# Altium project SAMA7D65-Curiosity.PrjPcb (part 4 of 12)

## Sheet 06 - SAMA7D65-DDR3L.SchDoc
size B; CompanyName: Microchip Technology Inc.; Organization: Microchip Technology; Address1: 2355 West Chandler Blvd.; Address2: Chandler, AZ  85224; Address4: USA; DocumentNumber: 6; SheetNumber: 6; SheetTotal: 15; SheetTitle: SAMA7D65 DDR3L
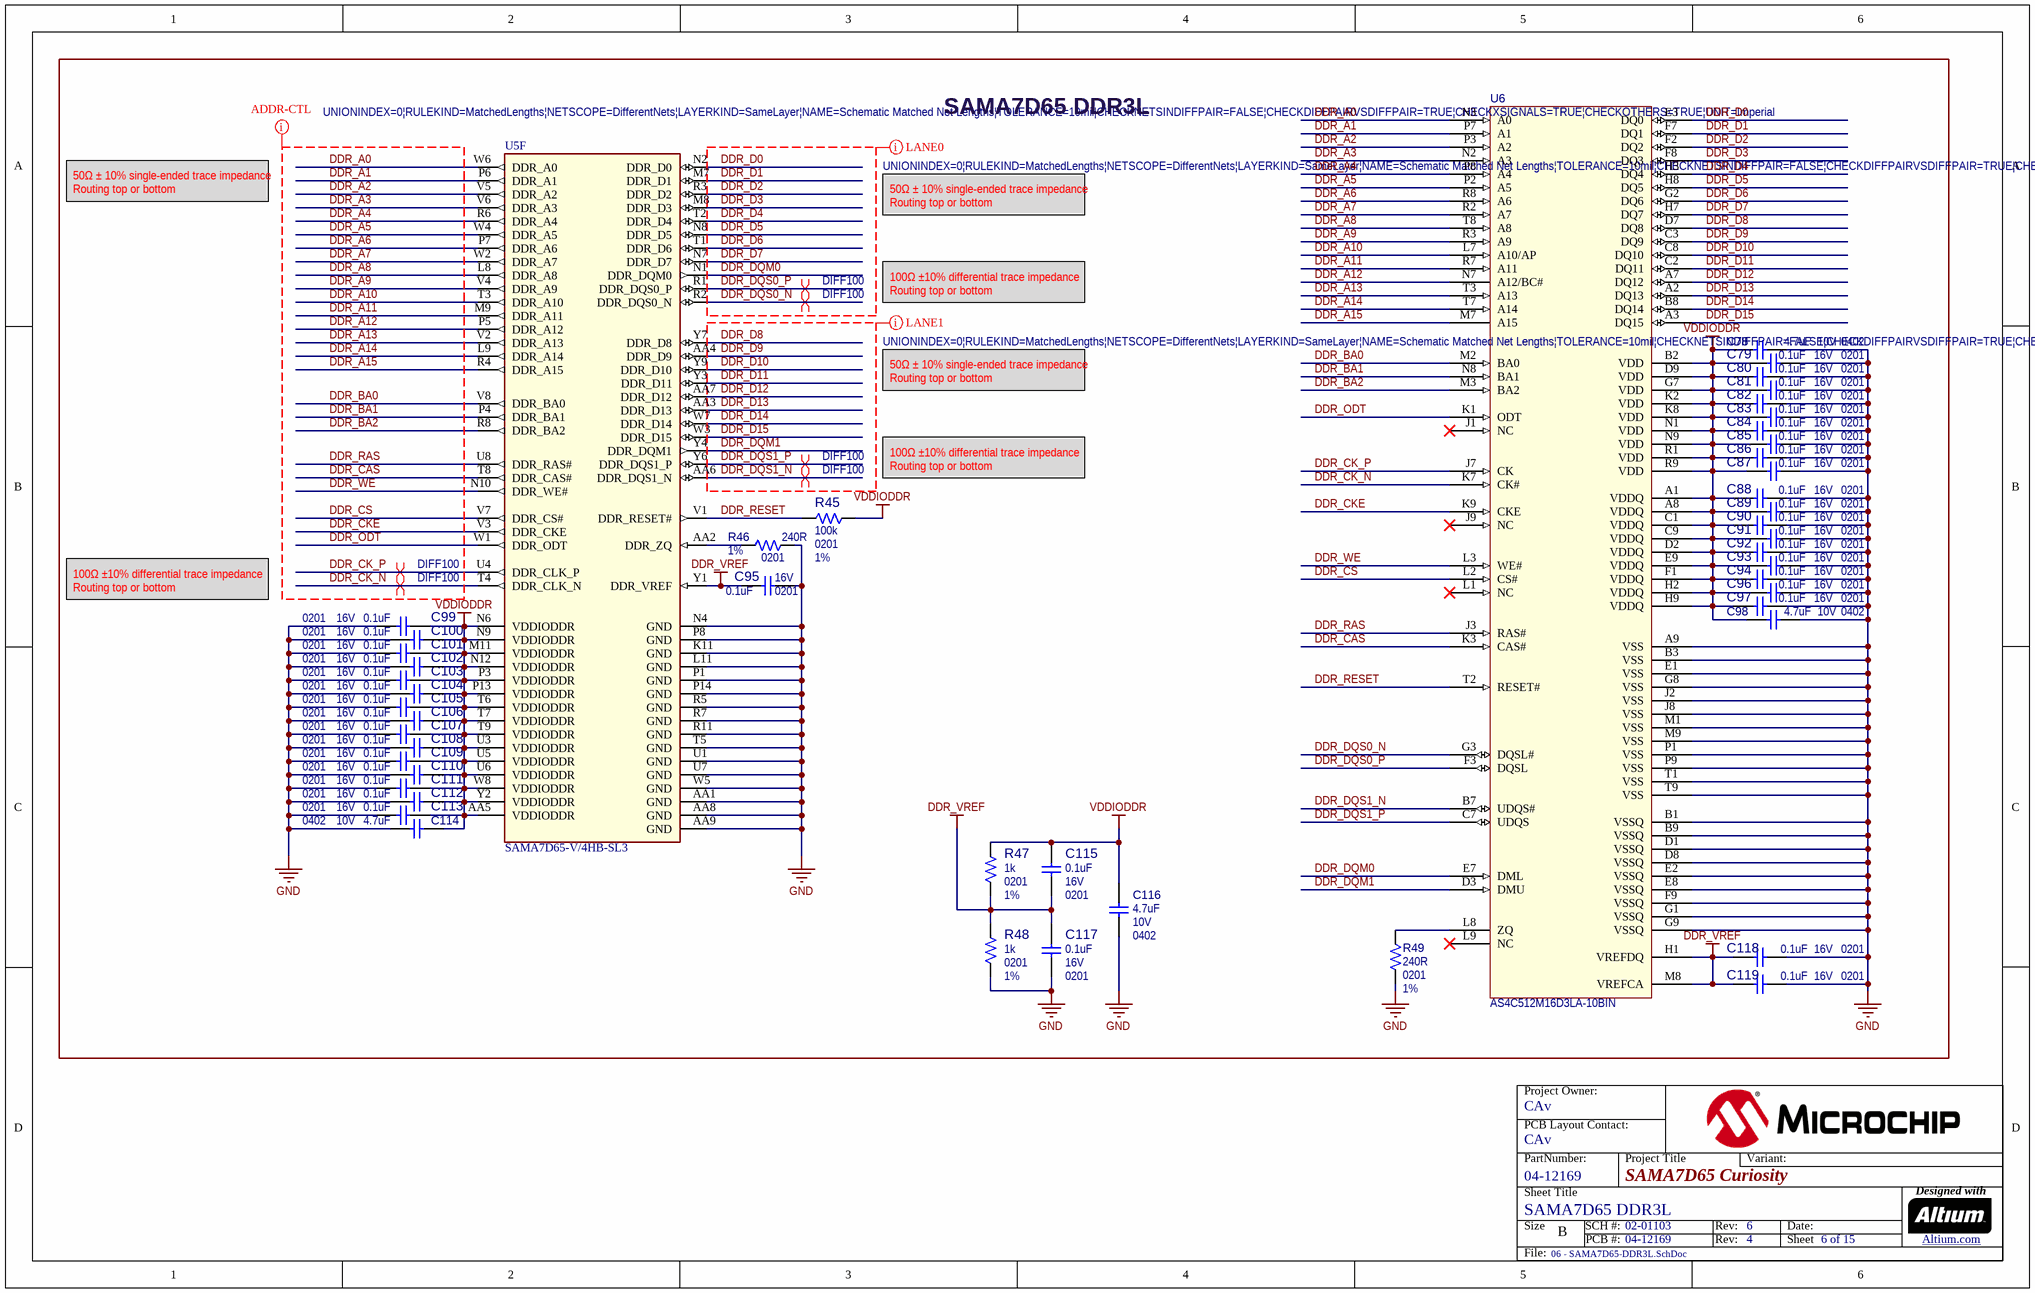
[diagram p5: 06 - SAMA7D65-DDR3L.SchDoc]

### Parts
C78  value 4.7uF  Voltage: 10V  Package: 0402  [CAP_C_0402]  (hidden comment: Capacitor NP)
C79  value 0.1uF  Voltage: 16V  Package: 0201  [CAP_C_0201]  (hidden comment: Capacitor NP)
C80  value 0.1uF  Voltage: 16V  Package: 0201  [CAP_C_0201]  (hidden comment: Capacitor NP)
C81  value 0.1uF  Voltage: 16V  Package: 0201  [CAP_C_0201]  (hidden comment: Capacitor NP)
C82  value 0.1uF  Voltage: 16V  Package: 0201  [CAP_C_0201]  (hidden comment: Capacitor NP)
C83  value 0.1uF  Voltage: 16V  Package: 0201  [CAP_C_0201]  (hidden comment: Capacitor NP)
C84  value 0.1uF  Voltage: 16V  Package: 0201  [CAP_C_0201]  (hidden comment: Capacitor NP)
C85  value 0.1uF  Voltage: 16V  Package: 0201  [CAP_C_0201]  (hidden comment: Capacitor NP)
C86  value 0.1uF  Voltage: 16V  Package: 0201  [CAP_C_0201]  (hidden comment: Capacitor NP)
C87  value 0.1uF  Voltage: 16V  Package: 0201  [CAP_C_0201]  (hidden comment: Capacitor NP)
C88  value 0.1uF  Voltage: 16V  Package: 0201  [CAP_C_0201]  (hidden comment: Capacitor NP)
C89  value 0.1uF  Voltage: 16V  Package: 0201  [CAP_C_0201]  (hidden comment: Capacitor NP)
C90  value 0.1uF  Voltage: 16V  Package: 0201  [CAP_C_0201]  (hidden comment: Capacitor NP)
C91  value 0.1uF  Voltage: 16V  Package: 0201  [CAP_C_0201]  (hidden comment: Capacitor NP)
C92  value 0.1uF  Voltage: 16V  Package: 0201  [CAP_C_0201]  (hidden comment: Capacitor NP)
C93  value 0.1uF  Voltage: 16V  Package: 0201  [CAP_C_0201]  (hidden comment: Capacitor NP)
C94  value 0.1uF  Voltage: 16V  Package: 0201  [CAP_C_0201]  (hidden comment: Capacitor NP)
C95  value 0.1uF  Voltage: 16V  Package: 0201  [CAP_C_0201]  (hidden comment: Capacitor NP)
C96  value 0.1uF  Voltage: 16V  Package: 0201  [CAP_C_0201]  (hidden comment: Capacitor NP)
C97  value 0.1uF  Voltage: 16V  Package: 0201  [CAP_C_0201]  (hidden comment: Capacitor NP)
C98  value 4.7uF  Voltage: 10V  Package: 0402  [CAP_C_0402]  (hidden comment: Capacitor NP)
C99  value 0.1uF  Voltage: 16V  Package: 0201  [CAP_C_0201]  (hidden comment: Capacitor NP)
C100  value 0.1uF  Voltage: 16V  Package: 0201  [CAP_C_0201]  (hidden comment: Capacitor NP)
C101  value 0.1uF  Voltage: 16V  Package: 0201  [CAP_C_0201]  (hidden comment: Capacitor NP)
C102  value 0.1uF  Voltage: 16V  Package: 0201  [CAP_C_0201]  (hidden comment: Capacitor NP)
C103  value 0.1uF  Voltage: 16V  Package: 0201  [CAP_C_0201]  (hidden comment: Capacitor NP)
C104  value 0.1uF  Voltage: 16V  Package: 0201  [CAP_C_0201]  (hidden comment: Capacitor NP)
C105  value 0.1uF  Voltage: 16V  Package: 0201  [CAP_C_0201]  (hidden comment: Capacitor NP)
C106  value 0.1uF  Voltage: 16V  Package: 0201  [CAP_C_0201]  (hidden comment: Capacitor NP)
C107  value 0.1uF  Voltage: 16V  Package: 0201  [CAP_C_0201]  (hidden comment: Capacitor NP)
C108  value 0.1uF  Voltage: 16V  Package: 0201  [CAP_C_0201]  (hidden comment: Capacitor NP)
C109  value 0.1uF  Voltage: 16V  Package: 0201  [CAP_C_0201]  (hidden comment: Capacitor NP)
C110  value 0.1uF  Voltage: 16V  Package: 0201  [CAP_C_0201]  (hidden comment: Capacitor NP)
C111  value 0.1uF  Voltage: 16V  Package: 0201  [CAP_C_0201]  (hidden comment: Capacitor NP)
C112  value 0.1uF  Voltage: 16V  Package: 0201  [CAP_C_0201]  (hidden comment: Capacitor NP)
C113  value 0.1uF  Voltage: 16V  Package: 0201  [CAP_C_0201]  (hidden comment: Capacitor NP)
C114  value 4.7uF  Voltage: 10V  Package: 0402  [CAP_C_0402]  (hidden comment: Capacitor NP)
C115  value 0.1uF  Voltage: 16V  Package: 0201  [CAP_C_0201]  (hidden comment: Capacitor NP)
C116  value 4.7uF  Voltage: 10V  Package: 0402  [CAP_C_0402]  (hidden comment: Capacitor NP)
C117  value 0.1uF  Voltage: 16V  Package: 0201  [CAP_C_0201]  (hidden comment: Capacitor NP)
C118  value 0.1uF  Voltage: 16V  Package: 0201  [CAP_C_0201]  (hidden comment: Capacitor NP)
C119  value 0.1uF  Voltage: 16V  Package: 0201  [CAP_C_0201]  (hidden comment: Capacitor NP)
R45  value 100k  Package: 0201  Tolerance: 1%  [RES_C_0201]  (hidden comment: Resistor)
R46  value 240R  Package: 0201  Tolerance: 1%  [RES_C_0201]  (hidden comment: Resistor)
R47  value 1k  Package: 0201  Tolerance: 1%  [RES_C_0201]  (hidden comment: Resistor)
R48  value 1k  Package: 0201  Tolerance: 1%  [RES_C_0201]  (hidden comment: Resistor)
R49  value 240R  Package: 0201  Tolerance: 1%  [RES_C_0201]  (hidden comment: Resistor)
U5  value SAMA7D65-V/4HB-SL3  [TFBGA-343_14x14]  (hidden comment: SAMA7D65)  (part F of 8)
U6  value AS4C512M16D3LA-10BIN  [TFBGA-96_13.5x9]  (hidden comment: AS4C512M16D3LA-10BIN TFBGA-96)

### Blocks framed on the sheet
SAMA7D65 DDR3L: C78-C119 R45-R49 U5 U6

### Nets
DDR_VREF: C95.1 C115.2 C117.1 C118.1 C119.1 R47.1 R48.2 U5.Y1(DDR_VREF) U6.H1(VREFDQ) U6.M8(VREFCA)
GND: C78.1 C79.2 C80.2 C81.2 C82.2 C83.2 C84.2 C85.2 C86.2 C87.2 C88.2 C89.2 C90.2 C91.2 C92.2 C93.2 C94.2 C95.2 C96.2 C97.2 C98.1 C99.2 C100.2 C101.2 C102.2 C103.2 C104.2 C105.2 C106.2 C107.2 C108.2 C109.2 C110.2 C111.2 C112.2 C113.2 C114.2 C116.1 C117.2 C118.2 C119.2 R46.2 R48.1 R49.1 U5.AA1(GND) U5.AA8(GND) U5.AA9(GND) U5.K11(GND) U5.L11(GND) U5.N4(GND) U5.P1(GND) U5.P8(GND) U5.P14(GND) U5.R5(GND) U5.R7(GND) U5.R11(GND) U5.T5(GND) U5.U1(GND) U5.U7(GND) U5.W5(GND) U6.A9(VSS) U6.B1(VSSQ) U6.B3(VSS) U6.B9(VSSQ) U6.D1(VSSQ) U6.D8(VSSQ) U6.E1(VSS) U6.E2(VSSQ) U6.E8(VSSQ) U6.F9(VSSQ) U6.G1(VSSQ) U6.G8(VSS) U6.G9(VSSQ) U6.J2(VSS) U6.J8(VSS) U6.M1(VSS) U6.M9(VSS) U6.P1(VSS) U6.P9(VSS) U6.T1(VSS) U6.T9(VSS)
VDDIODDR: C78.2 C79.1 C80.1 C81.1 C82.1 C83.1 C84.1 C85.1 C86.1 C87.1 C88.1 C89.1 C90.1 C91.1 C92.1 C93.1 C94.1 C96.1 C97.1 C98.2 C99.1 C100.1 C101.1 C102.1 C103.1 C104.1 C105.1 C106.1 C107.1 C108.1 C109.1 C110.1 C111.1 C112.1 C113.1 C114.1 C115.1 C116.2 R45.2 R47.2 U5.AA5(VDDIODDR) U5.M11(VDDIODDR) U5.N6(VDDIODDR) U5.N9(VDDIODDR) U5.N12(VDDIODDR) U5.P3(VDDIODDR) U5.P13(VDDIODDR) U5.T6(VDDIODDR) U5.T7(VDDIODDR) U5.T9(VDDIODDR) U5.U3(VDDIODDR) U5.U5(VDDIODDR) U5.U6(VDDIODDR) U5.W8(VDDIODDR) U5.Y2(VDDIODDR) U6.A1(VDDQ) U6.A8(VDDQ) U6.B2(VDD) U6.C1(VDDQ) U6.C9(VDDQ) U6.D2(VDDQ) U6.D9(VDD) U6.E9(VDDQ) U6.F1(VDDQ) U6.G7(VDD) U6.H2(VDDQ) U6.H9(VDDQ) U6.K2(VDD) U6.K8(VDD) U6.N1(VDD) U6.N9(VDD) U6.R1(VDD) U6.R9(VDD)
DDR_A0: U5.W6(DDR_A0) U6.N3(A0)
DDR_A1: U5.P6(DDR_A1) U6.P7(A1)
DDR_A2: U5.V5(DDR_A2) U6.P3(A2)
DDR_A3: U5.V6(DDR_A3) U6.N2(A3)
DDR_A4: U5.R6(DDR_A4) U6.P8(A4)
DDR_A5: U5.W4(DDR_A5) U6.P2(A5)
DDR_A6: U5.P7(DDR_A6) U6.R8(A6)
DDR_A7: U5.W2(DDR_A7) U6.R2(A7)
DDR_A8: U5.L8(DDR_A8) U6.T8(A8)
DDR_A9: U5.V4(DDR_A9) U6.R3(A9)
DDR_A10: U5.T3(DDR_A10) U6.L7(A10/AP)
DDR_A11: U5.M9(DDR_A11) U6.R7(A11)
DDR_A12: U5.P5(DDR_A12) U6.N7(A12/BC#)
DDR_A13: U5.V2(DDR_A13) U6.T3(A13)
DDR_A14: U5.L9(DDR_A14) U6.T7(A14)
DDR_A15: U5.R4(DDR_A15) U6.M7(A15)
DDR_BA0: U5.V8(DDR_BA0) U6.M2(BA0)
DDR_BA1: U5.P4(DDR_BA1) U6.N8(BA1)
DDR_BA2: U5.R8(DDR_BA2) U6.M3(BA2)
DDR_CAS: U5.T8(DDR_CAS#) U6.K3(CAS#)
DDR_CK_N: U5.T4(DDR_CLK_N) U6.K7(CK#)
DDR_CK_P: U5.U4(DDR_CLK_P) U6.J7(CK)
DDR_CKE: U5.V3(DDR_CKE) U6.K9(CKE)
DDR_CS: U5.V7(DDR_CS#) U6.L2(CS#)
DDR_D0: U5.N2(DDR_D0) U6.E3(DQ0)
DDR_D1: U5.M7(DDR_D1) U6.F7(DQ1)
DDR_D2: U5.R3(DDR_D2) U6.F2(DQ2)
DDR_D3: U5.M8(DDR_D3) U6.F8(DQ3)
DDR_D4: U5.T2(DDR_D4) U6.H3(DQ4)
DDR_D5: U5.N8(DDR_D5) U6.H8(DQ5)
DDR_D6: U5.T1(DDR_D6) U6.G2(DQ6)
DDR_D7: U5.N7(DDR_D7) U6.H7(DQ7)
DDR_D8: U5.Y7(DDR_D8) U6.D7(DQ8)
DDR_D9: U5.AA4(DDR_D9) U6.C3(DQ9)
DDR_D10: U5.Y9(DDR_D10) U6.C8(DQ10)
DDR_D11: U5.Y3(DDR_D11) U6.C2(DQ11)
DDR_D12: U5.AA7(DDR_D12) U6.A7(DQ12)
DDR_D13: U5.AA3(DDR_D13) U6.A2(DQ13)
DDR_D14: U5.W7(DDR_D14) U6.B8(DQ14)
DDR_D15: U5.W3(DDR_D15) U6.A3(DQ15)
DDR_DQM0: U5.N1(DDR_DQM0) U6.E7(DML)
DDR_DQM1: U5.Y4(DDR_DQM1) U6.D3(DMU)
DDR_DQS0_N: U5.R2(DDR_DQS0_N) U6.G3(DQSL#)
DDR_DQS0_P: U5.R1(DDR_DQS0_P) U6.F3(DQSL)
DDR_DQS1_N: U5.AA6(DDR_DQS1_N) U6.B7(UDQS#)
DDR_DQS1_P: U5.Y6(DDR_DQS1_P) U6.C7(UDQS)
DDR_ODT: U5.W1(DDR_ODT) U6.K1(ODT)
DDR_RAS: U5.U8(DDR_RAS#) U6.J3(RAS#)
DDR_RESET: R45.1 U5.V1(DDR_RESET#) U6.T2(RESET#)
DDR_WE: U5.N10(DDR_WE#) U6.L3(WE#)
NetR46_1: R46.1 U5.AA2(DDR_ZQ)
NetR49_2: R49.2 U6.L8(ZQ)

Not connected (* = marked no-connect by the designer): U6 J1(NC)* J9(NC)* L1(NC)* L9(NC)*

### Layout directives
net class DDR-ADDR-CTL; rule Matched Net Lengths [Tolerance = 10mil]: DDR_A0, DDR_A1, DDR_A2, DDR_A3, DDR_A4, DDR_A5, DDR_A6, DDR_A7, DDR_A8, DDR_A9, DDR_A10, DDR_A11, DDR_A12, DDR_A13, DDR_A14, DDR_A15, DDR_BA0, DDR_BA1, DDR_BA2, DDR_CAS, DDR_CK_N, DDR_CK_P, DDR_CKE, DDR_CS, DDR_ODT, DDR_RAS, DDR_WE
differential pair; differential pair class DIFF100; net class DIFF100; rule Matched Net Lengths [Tolerance = 4mil]: DDR_CK_N, DDR_CK_P, DDR_DQS0_N, DDR_DQS0_P, DDR_DQS1_N, DDR_DQS1_P
net class DDR-LANE0; rule Matched Net Lengths [Tolerance = 10mil]: DDR_D0, DDR_D1, DDR_D2, DDR_D3, DDR_D4, DDR_D5, DDR_D6, DDR_D7, DDR_DQM0, DDR_DQS0_N, DDR_DQS0_P
net class DDR-LANE1; rule Matched Net Lengths [Tolerance = 10mil]: DDR_D8, DDR_D9, DDR_D10, DDR_D11, DDR_D12, DDR_D13, DDR_D14, DDR_D15, DDR_DQM1, DDR_DQS1_N, DDR_DQS1_P

### Notes on the sheet
- 50Ω ± 10% single-ended trace impedance
  Routing top or bottom
- 100Ω ±10% differential trace impedance
  Routing top or bottom
- Project Owner:
- PCB Layout Contact:
- PartNumber:
- Project Title
- Variant:
- Sheet Title
- Size
- B
- SCH #:
- PCB #:
- Rev:
- Date:
- Sheet
- Designed with
- Altium.com <http://go.altium.com/MicrochipLandingPage_Evaluation.html>
- File:

### Library data of the parts
C78 C98 C114 C116 = CAP1684: Capacitor; Manufacturer 1: TDK Corporation; Manufacturer Part Number 1: C1005X5R1A475K050BC; Description_: CAP CER 4.7uF 10V 10% X5R SMD 0402; Dev Tools Status: Production; Tolerance: 10%; Temperature Coeffcient: X5R; Type: Ceramic; Owner: Jesus Aviles; Populated: YES; MCHP-ID: CAP1684; Revision: 1; Symbol: Capacitor NP; Status: MCL Design; ComponentLink1Description: SVN Datasheet; ComponentLink2Description: Local Datasheet; ComponentLink3URL: C:\ALTIUM_WORK\00001_MCHP-CDB\Library\LibraryRefs\Capacitor NP.SchLib; ComponentLink3Description: Open Symbol; ComponentLink4URL: C:\ALTIUM_WORK\00001_MCHP-CDB\Library\Footprints\CAP_C_0402.PcbLib; ComponentLink4Description: Open Footprint; ComponentLink5Description: Open Footprint 2; ComponentLink6Description: Open Footprint 3; ComponentLink7Description: Open Footprint 4; Operating Temperature: -55C to 85C; Category: Capacitor; Supplier 1: Digi-Key; Supplier Part Number 1: 445-13820-1-ND; Quantity Override: 1
C79-C97 C99-C113 C115 C117-C119 = CAP1978: Manufacturer 1: D3_Murata Electronics; Manufacturer Part Number 1: GRM033C71C104KE14J; Description_: CAP CER 0.1uF 16V 10% X7S 0201; Dev Tools Status: Production; Tolerance: 10%; Owner: Dragos Danaila; Populated: YES; Temperature Coefficient: X7S; Restricted Sourcing: No; MCHP-ID: CAP1978; Revision: 2; Symbol: Capacitor NP; Status: MCL Design; ComponentLink1URL: https://chn-vm-apps.microchip.com/mchprepo/parts/Datasheets/GRM033C71C104KE14-01.pdf; ComponentLink1Description: SVN Datasheet; ComponentLink2URL: C:\ALTIUM_WORK\00001_MCHP-CDB\Datasheets\GRM033C71C104KE14-01.pdf; ComponentLink2Description: Local Datasheet; ComponentLink3URL: C:\ALTIUM_WORK\00001_MCHP-CDB\Library\LibraryRefs\Capacitor NP.SchLib; ComponentLink3Description: Open Symbol; ComponentLink4URL: C:\ALTIUM_WORK\00001_MCHP-CDB\Library\Footprints\CAP_C_0201.PcbLib; ComponentLink4Description: Open Footprint; ComponentLink5Description: Open Footprint 2; ComponentLink6Description: Open Footprint 3; ComponentLink7Description: Open Footprint 4; Operating Temperature: -55C to +125C; Category: Capacitor; Supplier 1: Mouser; Supplier Part Number 1: 81-GRM033C71C104KE4J; Quantity Override: 1; Manufacturer 2: D3_Murata Electronics; Manufacturer Part Number 2: GRM033C71C104KE14E; Manufacturer 3: Murata; Manufacturer Part Number 3: GRM033C71C104KE14D; Supplier 2: Mouser; Supplier Part Number 2: 81-GRM033C71C104KE4E; Supplier 3: Digi-Key; Supplier Part Number 3: 490-10387-1-ND
R45 = RSMT1356: Manufacturer 1: Stackpole Electronics Inc; Manufacturer Part Number 1: RMCF0201FT100K; Description_: RES TKF 100k 1% 1/20W SMD 0201; Dev Tools Status: Production; Voltage: 25V; Power: 1/20W; Owner: Ciprian Abramov; Populated: YES; Temperature Coefficient: 200ppm/C; Restricted Sourcing: No; MCHP-ID: RSMT1356; Revision: 2; Symbol: Resistor; Status: MCL Design; ComponentLink1URL: https://chn-vm-apps.microchip.com/mchprepo/parts/Datasheets/sei-rmcf_rmcp.pdf; ComponentLink1Description: SVN Datasheet; ComponentLink2URL: C:\ALTIUM_WORK\00001_MCHP-CDB\Datasheets\sei-rmcf_rmcp.pdf; ComponentLink2Description: Local Datasheet; ComponentLink3URL: C:\ALTIUM_WORK\00001_MCHP-CDB\Library\LibraryRefs\Resistor.SchLib; ComponentLink3Description: Open Symbol; ComponentLink4URL: C:\ALTIUM_WORK\00001_MCHP-CDB\Library\Footprints\RES_C_0201.PcbLib; ComponentLink4Description: Open Footprint; ComponentLink5Description: Open Footprint 2; ComponentLink6Description: Open Footprint 3; ComponentLink7Description: Open Footprint 4; Operating Temperature: -55C to +125C; Category: Resistor; Type: RES SMD; Composition: TKF; Supplier 1: Digi-Key; Supplier Part Number 1: RMCF0201FT100KCT-ND; Quantity Override: 1
R46 R49 = RSMT1249: Manufacturer 1: Yageo; Manufacturer Part Number 1: RC0201FR-07240RL; Description_: RES TKF 240R 1% 1/20W SMD 0201; Dev Tools Status: Production; Voltage: 25V; Temperature Coefficient: 200ppm; Current: 0.5A; Power: 1/20W; Owner: Dragos Danaila; Populated: YES; MCHP-ID: RSMT1249; Revision: 1; Symbol: Resistor; Status: MCL Design; ComponentLink1URL: https://chn-vm-apps.microchip.com/mchprepo/parts/Datasheets/PYu-RC_Group_51_RoHS_L_9.pdf; ComponentLink1Description: SVN Datasheet; ComponentLink2URL: C:\ALTIUM_WORK\00001_MCHP-CDB\Datasheets\PYu-RC_Group_51_RoHS_L_9.pdf; ComponentLink2Description: Local Datasheet; ComponentLink3URL: C:\ALTIUM_WORK\00001_MCHP-CDB\Library\LibraryRefs\Resistor.SchLib; ComponentLink3Description: Open Symbol; ComponentLink4URL: C:\ALTIUM_WORK\00001_MCHP-CDB\Library\Footprints\RES_C_0201.PcbLib; ComponentLink4Description: Open Footprint; ComponentLink5Description: Open Footprint 2; ComponentLink6Description: Open Footprint 3; ComponentLink7Description: Open Footprint 4; Operating Temperature: -55C to +125C; Category: Resistor; Type: RES SMD; Composition: TKF; Supplier 1: Digi-Key; Supplier Part Number 1: YAG2528CT-ND; Quantity Override: 1
R47 R48 = RES1588: Manufacturer 1: Vishay; Manufacturer Part Number 1: CRCW02011K00FNED; Description_: RES TKF 1k 1% 1/20W SMD 0201; Dev Tools Status: Production; Voltage: 25V; Power: 1/20W; Owner: Gabor Bihari; Populated: YES; MCHP-ID: RES1588; Revision: 3; Symbol: Resistor; Status: MCL Design; ComponentLink1URL: https://chn-vm-apps.microchip.com/mchprepo/parts/Datasheets/ERJ_G,R,E_Rev08.pdf; ComponentLink1Description: SVN Datasheet; ComponentLink2URL: C:\ALTIUM_WORK\00001_MCHP-CDB\Datasheets\ERJ_G,R,E_Rev08.pdf; ComponentLink2Description: Local Datasheet; ComponentLink3URL: C:\ALTIUM_WORK\00001_MCHP-CDB\Library\LibraryRefs\Resistor.SchLib; ComponentLink3Description: Open Symbol; ComponentLink4URL: C:\ALTIUM_WORK\00001_MCHP-CDB\Library\Footprints\RES_C_0201.PcbLib; ComponentLink4Description: Open Footprint; ComponentLink5Description: Open Footprint 2; ComponentLink6Description: Open Footprint 3; ComponentLink7Description: Open Footprint 4; Operating Temperature: -55°C to 125°C; Category: Resistor; Type: RES SMD; Composition: TKF; Supplier 1: Digi-Key; Supplier Part Number 1: 541-1.00KABTR-ND; Quantity Override: 1
U5 = IC2674: SAMA7D65 MPU 1000MHz Cortex-A7 TFBGA-343; Manufacturer 1: Microchip Technology; MCHP-ID: IC2674; Description_: MCHP MPU 32-BIT Cortex-A7 1000MHz 128kB SAMA7D65-V/4HB-SL3 TFBGA-343; Dev Tools Status: Design; Owner: Ciprian Abramov; Populated: YES; Restricted Sourcing: No; Symbol: SAMA7D65-TFBGA-343; Type: 32-Bit MPU; Status: MCL Design; Revision: 1; Category: MCHP-Microcontroller; ComponentLink1URL: https://www.microchip.com/sitesearch/search/Product%20and%20Development%20Tools/SAMA7D65-V/4HB-SL3; ComponentLink1Description: SVN Datasheet; ComponentLink2Description: Local Datasheet; ComponentLink3URL: C:\ALTIUM_WORK\00001_MCHP-CDB\Library\LibraryRefs\SAMA7D65-TFBGA-343.SchLib; ComponentLink3Description: Open Symbol; ComponentLink4URL: C:\ALTIUM_WORK\00001_MCHP-CDB\Library\Footprints\TFBGA-343_14x14.PcbLib; ComponentLink4Description: Open Footprint; ComponentLink5Description: Open Footprint 2; ComponentLink6Description: Open Footprint 3; ComponentLink7Description: Open Footprint 4; Manufacturer Part Number 1: SAMA7D65-V/4HB-SL3; Supplier 1: Microchip Technology; Supplier Part Number 1: SAMA7D65-V/4HB-SL3; Operating Temperature: -40C to +105C; Quantity Override: 1
U6 = IC1748: 8Gb DDR3L-1866 SDRAM, 512Mb x 16, -40C to +95C; Manufacturer 1: Alliance Memory, Inc.; MCHP-ID: IC1748; Description_: IC MEMORY AS4C512M16D3LA-10BIN DDR3L 8Gb 933MHz FBGA-96; Dev Tools Status: Design; Vin: 1.35V; Owner: Ciprian Abramov; Populated: YES; Restricted Sourcing: No; Revision: 1; Symbol: AS4C512M16D3LA-10BIN TFBGA-96; Status: MCL Design; Package: TFBGA-96; ComponentLink1URL: https://chn-vm-apps.microchip.com/mchprepo/parts/Datasheets/AllianceMemory_DDR3L_8G_AS4C512M16D3LA-10BCN-BIN-BAN_Feb2019_v1.0.pdf; ComponentLink1Description: SVN Datasheet; ComponentLink2URL: C:\ALTIUM_WORK\00001_MCHP-CDB\Datasheets\AllianceMemory_DDR3L_8G_AS4C512M16D3LA-10BCN-BIN-BAN_Feb2019_v1.0.pdf; ComponentLink2Description: Local Datasheet; ComponentLink3URL: C:\ALTIUM_WORK\00001_MCHP-CDB\Library\LibraryRefs\AS4C512M16D3LA-10BIN TFBGA-96.SchLib; ComponentLink3Description: Open Symbol; ComponentLink4URL: C:\ALTIUM_WORK\00001_MCHP-CDB\Library\Footprints\TFBGA-96_13.5x9.PcbLib; ComponentLink4Description: Open Footprint; ComponentLink5Description: Open Footprint 2; ComponentLink6Description: Open Footprint 3; ComponentLink7Description: Open Footprint 4; Operating Temperature: -40C to +95C; Type: Memory; Category: IC; Manufacturer Part Number 1: AS4C512M16D3LA-10BIN; Supplier 1: Digi-Key; Supplier Part Number 1: 1450-1488-ND; Quantity Override: 1

## Sheet 07 - SAMA7D65-PIO.SchDoc
size B; CompanyName: Microchip Technology Inc.; Organization: Microchip Technology; Address1: 2355 West Chandler Blvd.; Address2: Chandler, AZ  85224; Address4: USA; DocumentNumber: 7; SheetNumber: 7; SheetTotal: 15; SheetTitle: PIO Asignment
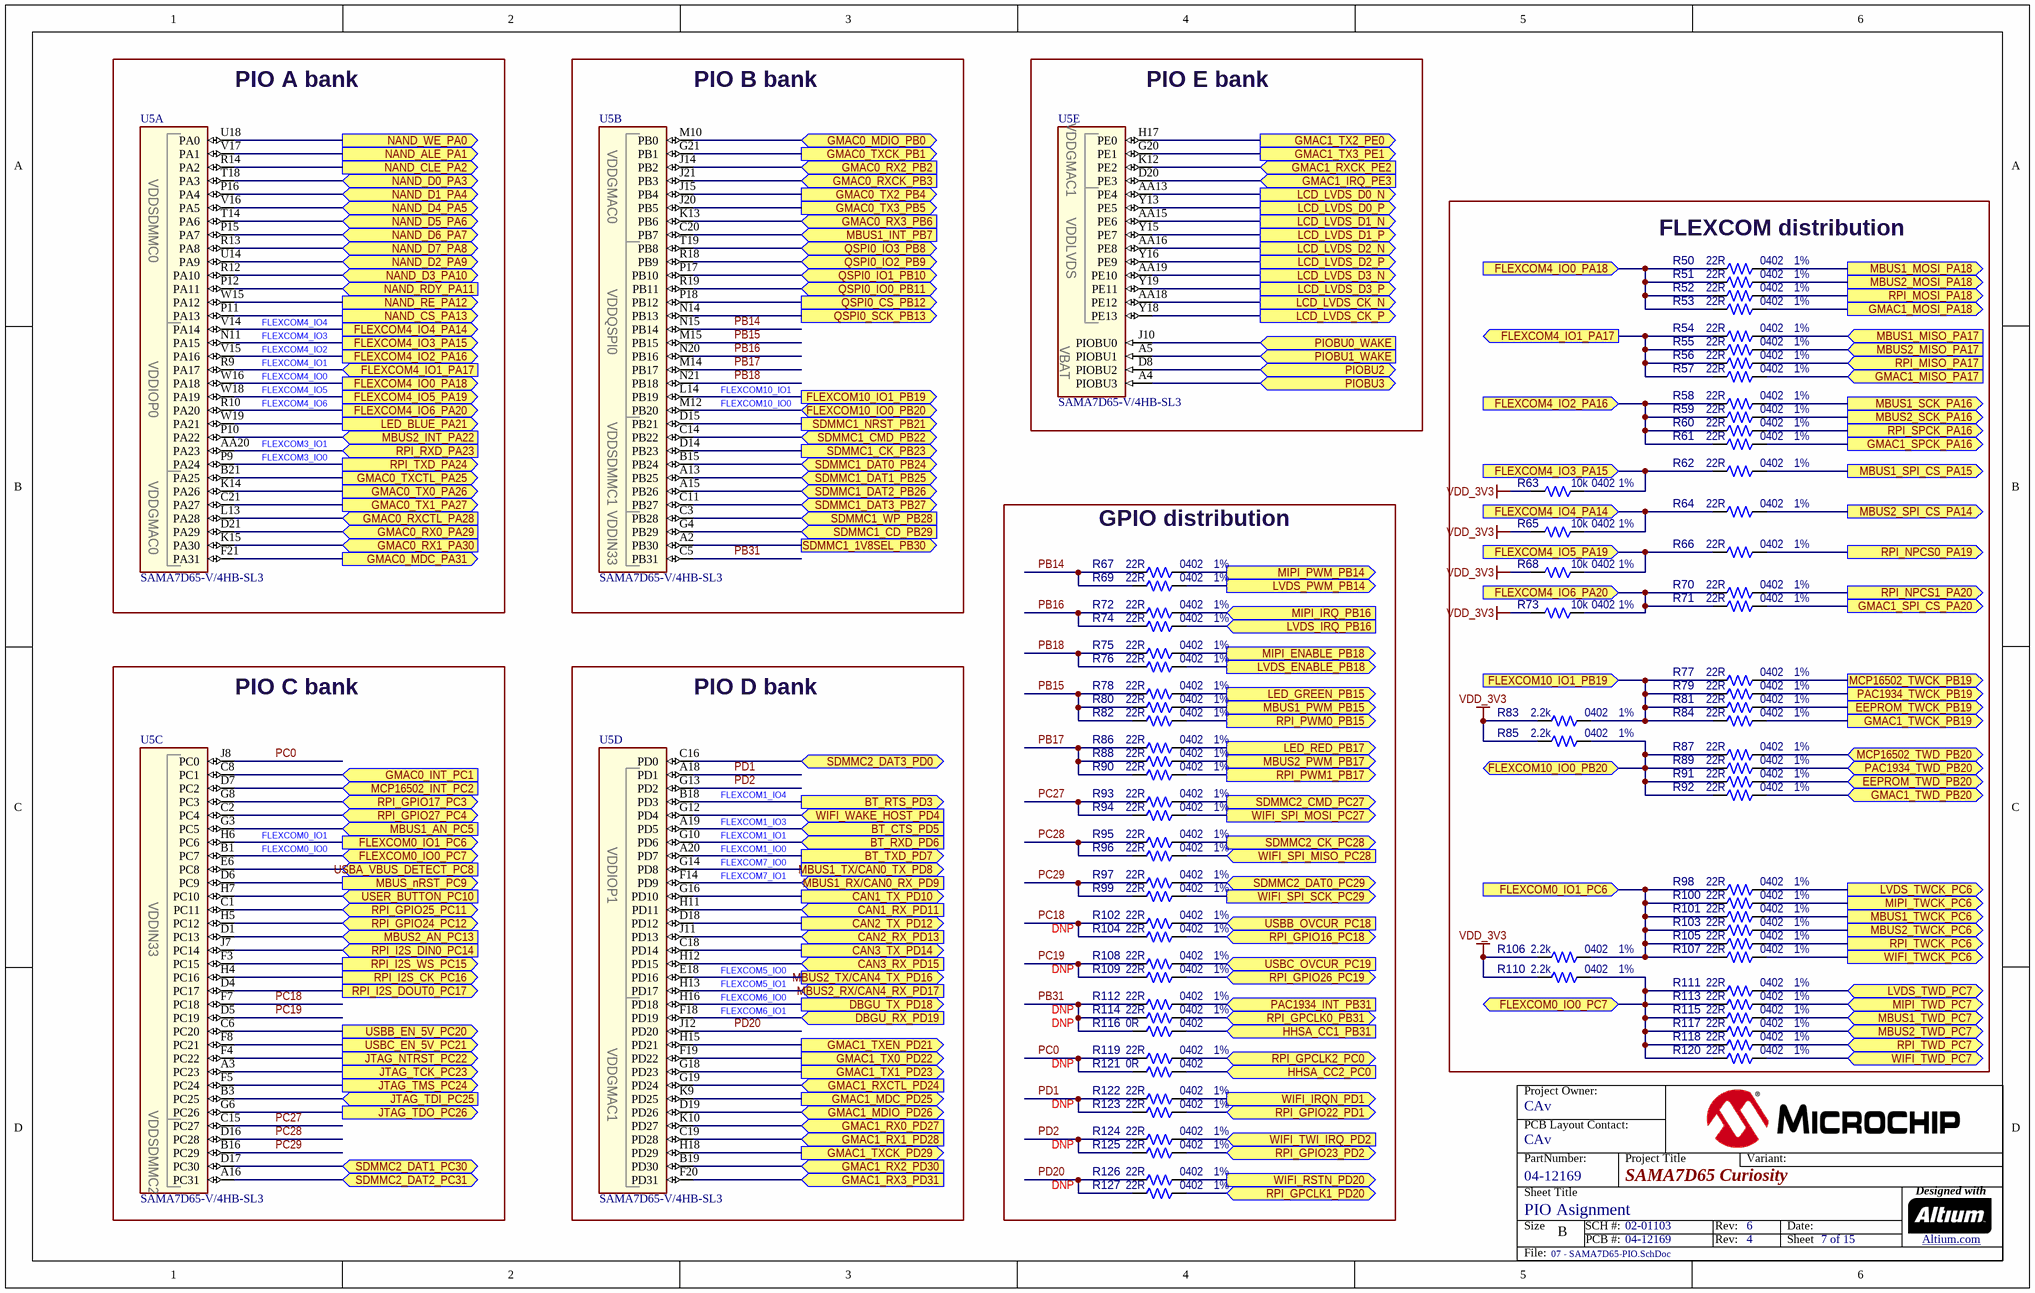
[diagram p6: 07 - SAMA7D65-PIO.SchDoc]

### Parts
R50  value 22R  Package: 0402  Tolerance: 1%  [RES_C_0402]  (hidden comment: Resistor)
R51  value 22R  Package: 0402  Tolerance: 1%  [RES_C_0402]  (hidden comment: Resistor)
R52  value 22R  Package: 0402  Tolerance: 1%  [RES_C_0402]  (hidden comment: Resistor)
R53  value 22R  Package: 0402  Tolerance: 1%  [RES_C_0402]  (hidden comment: Resistor)
R54  value 22R  Package: 0402  Tolerance: 1%  [RES_C_0402]  (hidden comment: Resistor)
R55  value 22R  Package: 0402  Tolerance: 1%  [RES_C_0402]  (hidden comment: Resistor)
R56  value 22R  Package: 0402  Tolerance: 1%  [RES_C_0402]  (hidden comment: Resistor)
R57  value 22R  Package: 0402  Tolerance: 1%  [RES_C_0402]  (hidden comment: Resistor)
R58  value 22R  Package: 0402  Tolerance: 1%  [RES_C_0402]  (hidden comment: Resistor)
R59  value 22R  Package: 0402  Tolerance: 1%  [RES_C_0402]  (hidden comment: Resistor)
R60  value 22R  Package: 0402  Tolerance: 1%  [RES_C_0402]  (hidden comment: Resistor)
R61  value 22R  Package: 0402  Tolerance: 1%  [RES_C_0402]  (hidden comment: Resistor)
R62  value 22R  Package: 0402  Tolerance: 1%  [RES_C_0402]  (hidden comment: Resistor)
R63  value 10k  Package: 0402  Tolerance: 1%  [RES_C_0402]  (hidden comment: Resistor)
R64  value 22R  Package: 0402  Tolerance: 1%  [RES_C_0402]  (hidden comment: Resistor)
R65  value 10k  Package: 0402  Tolerance: 1%  [RES_C_0402]  (hidden comment: Resistor)
R66  value 22R  Package: 0402  Tolerance: 1%  [RES_C_0402]  (hidden comment: Resistor)
R67  value 22R  Package: 0402  Tolerance: 1%  [RES_C_0402]  (hidden comment: Resistor)
R68  value 10k  Package: 0402  Tolerance: 1%  [RES_C_0402]  (hidden comment: Resistor)
R69  value 22R  Package: 0402  Tolerance: 1%  [RES_C_0402]  (hidden comment: Resistor)
R70  value 22R  Package: 0402  Tolerance: 1%  [RES_C_0402]  (hidden comment: Resistor)
R71  value 22R  Package: 0402  Tolerance: 1%  [RES_C_0402]  (hidden comment: Resistor)
R72  value 22R  Package: 0402  Tolerance: 1%  [RES_C_0402]  (hidden comment: Resistor)
R73  value 10k  Package: 0402  Tolerance: 1%  [RES_C_0402]  (hidden comment: Resistor)
R74  value 22R  Package: 0402  Tolerance: 1%  [RES_C_0402]  (hidden comment: Resistor)
R75  value 22R  Package: 0402  Tolerance: 1%  [RES_C_0402]  (hidden comment: Resistor)
R76  value 22R  Package: 0402  Tolerance: 1%  [RES_C_0402]  (hidden comment: Resistor)
R77  value 22R  Package: 0402  Tolerance: 1%  [RES_C_0402]  (hidden comment: Resistor)
R78  value 22R  Package: 0402  Tolerance: 1%  [RES_C_0402]  (hidden comment: Resistor)
R79  value 22R  Package: 0402  Tolerance: 1%  [RES_C_0402]  (hidden comment: Resistor)
R80  value 22R  Package: 0402  Tolerance: 1%  [RES_C_0402]  (hidden comment: Resistor)
R81  value 22R  Package: 0402  Tolerance: 1%  [RES_C_0402]  (hidden comment: Resistor)
R82  value 22R  Package: 0402  Tolerance: 1%  [RES_C_0402]  (hidden comment: Resistor)
R83  value 2.2k  Package: 0402  Tolerance: 1%  [RES_C_0402]  (hidden comment: Resistor)
R84  value 22R  Package: 0402  Tolerance: 1%  [RES_C_0402]  (hidden comment: Resistor)
R85  value 2.2k  Package: 0402  Tolerance: 1%  [RES_C_0402]  (hidden comment: Resistor)
R86  value 22R  Package: 0402  Tolerance: 1%  [RES_C_0402]  (hidden comment: Resistor)
R87  value 22R  Package: 0402  Tolerance: 1%  [RES_C_0402]  (hidden comment: Resistor)
R88  value 22R  Package: 0402  Tolerance: 1%  [RES_C_0402]  (hidden comment: Resistor)
R89  value 22R  Package: 0402  Tolerance: 1%  [RES_C_0402]  (hidden comment: Resistor)
R90  value 22R  Package: 0402  Tolerance: 1%  [RES_C_0402]  (hidden comment: Resistor)
R91  value 22R  Package: 0402  Tolerance: 1%  [RES_C_0402]  (hidden comment: Resistor)
R92  value 22R  Package: 0402  Tolerance: 1%  [RES_C_0402]  (hidden comment: Resistor)
R93  value 22R  Package: 0402  Tolerance: 1%  [RES_C_0402]  (hidden comment: Resistor)
R94  value 22R  Package: 0402  Tolerance: 1%  [RES_C_0402]  (hidden comment: Resistor)
R95  value 22R  Package: 0402  Tolerance: 1%  [RES_C_0402]  (hidden comment: Resistor)
R96  value 22R  Package: 0402  Tolerance: 1%  [RES_C_0402]  (hidden comment: Resistor)
R97  value 22R  Package: 0402  Tolerance: 1%  [RES_C_0402]  (hidden comment: Resistor)
R98  value 22R  Package: 0402  Tolerance: 1%  [RES_C_0402]  (hidden comment: Resistor)
R99  value 22R  Package: 0402  Tolerance: 1%  [RES_C_0402]  (hidden comment: Resistor)
R100  value 22R  Package: 0402  Tolerance: 1%  [RES_C_0402]  (hidden comment: Resistor)
R101  value 22R  Package: 0402  Tolerance: 1%  [RES_C_0402]  (hidden comment: Resistor)
R102  value 22R  Package: 0402  Tolerance: 1%  [RES_C_0402]  (hidden comment: Resistor)
R103  value 22R  Package: 0402  Tolerance: 1%  [RES_C_0402]  (hidden comment: Resistor)
R104  value 22R  Package: 0402  Populated: DNP  Tolerance: 1%  [RES_C_0402]  (hidden comment: Resistor)
R105  value 22R  Package: 0402  Tolerance: 1%  [RES_C_0402]  (hidden comment: Resistor)
R106  value 2.2k  Package: 0402  Tolerance: 1%  [RES_C_0402]  (hidden comment: Resistor)
R107  value 22R  Package: 0402  Tolerance: 1%  [RES_C_0402]  (hidden comment: Resistor)
R108  value 22R  Package: 0402  Tolerance: 1%  [RES_C_0402]  (hidden comment: Resistor)
R109  value 22R  Package: 0402  Populated: DNP  Tolerance: 1%  [RES_C_0402]  (hidden comment: Resistor)
R110  value 2.2k  Package: 0402  Tolerance: 1%  [RES_C_0402]  (hidden comment: Resistor)
R111  value 22R  Package: 0402  Tolerance: 1%  [RES_C_0402]  (hidden comment: Resistor)
R112  value 22R  Package: 0402  Tolerance: 1%  [RES_C_0402]  (hidden comment: Resistor)
R113  value 22R  Package: 0402  Tolerance: 1%  [RES_C_0402]  (hidden comment: Resistor)
R114  value 22R  Package: 0402  Populated: DNP  Tolerance: 1%  [RES_C_0402]  (hidden comment: Resistor)
R115  value 22R  Package: 0402  Tolerance: 1%  [RES_C_0402]  (hidden comment: Resistor)
R116  value 0R  Package: 0402  Populated: DNP  [RES_C_0402]  (hidden comment: Resistor)
R117  value 22R  Package: 0402  Tolerance: 1%  [RES_C_0402]  (hidden comment: Resistor)
R118  value 22R  Package: 0402  Tolerance: 1%  [RES_C_0402]  (hidden comment: Resistor)
R119  value 22R  Package: 0402  Tolerance: 1%  [RES_C_0402]  (hidden comment: Resistor)
R120  value 22R  Package: 0402  Tolerance: 1%  [RES_C_0402]  (hidden comment: Resistor)
R121  value 0R  Package: 0402  Populated: DNP  [RES_C_0402]  (hidden comment: Resistor)
R122  value 22R  Package: 0402  Tolerance: 1%  [RES_C_0402]  (hidden comment: Resistor)
R123  value 22R  Package: 0402  Populated: DNP  Tolerance: 1%  [RES_C_0402]  (hidden comment: Resistor)
R124  value 22R  Package: 0402  Tolerance: 1%  [RES_C_0402]  (hidden comment: Resistor)
R125  value 22R  Package: 0402  Populated: DNP  Tolerance: 1%  [RES_C_0402]  (hidden comment: Resistor)
R126  value 22R  Package: 0402  Tolerance: 1%  [RES_C_0402]  (hidden comment: Resistor)
R127  value 22R  Package: 0402  Populated: DNP  Tolerance: 1%  [RES_C_0402]  (hidden comment: Resistor)
U5  value SAMA7D65-V/4HB-SL3  [TFBGA-343_14x14]  (hidden comment: SAMA7D65)  (parts A,B,C,D,E of 8)

### Blocks framed on the sheet
PIO A bank: U5
PIO B bank: U5
PIO E bank: U5
FLEXCOM distribution: R50-R66 R68 R70 R71 R73 R77 R79 R81 R83-R85 R87 R89 R91 R92 R98 R100 R101 R103 R105-R107 R110 R111 R113 R115 R117 R118 R120
GPIO distribution: R67 R69 R72 R74-R76 R78 R80 R82 R86 R88 R90 R93-R97 R99 R102 R104 R108 R109 R112 R114 R116 R119 R121-R127
PIO C bank: U5
PIO D bank: U5

### Ports
BT_CTS_PD5 (in), BT_RTS_PD3 (out), BT_RXD_PD6 (in), BT_TXD_PD7 (out), CAN1_RX_PD11 (in), CAN1_TX_PD10 (out), CAN2_RX_PD13 (in), CAN2_TX_PD12 (out), CAN3_RX_PD15 (in), CAN3_TX_PD14 (out), DBGU_RX_PD19 (in), DBGU_TX_PD18 (out), EEPROM_TWCK_PB19 (out), EEPROM_TWD_PB20 (bidir), FLEXCOM0_IO0_PC7 (bidir), FLEXCOM0_IO1_PC6 (in), FLEXCOM0_IO1_PC6 (out), FLEXCOM4_IO0_PA18 (in), FLEXCOM4_IO0_PA18 (out), FLEXCOM4_IO1_PA17 (in), FLEXCOM4_IO1_PA17 (out), FLEXCOM4_IO2_PA16 (in), FLEXCOM4_IO2_PA16 (out), FLEXCOM4_IO3_PA15 (in), FLEXCOM4_IO3_PA15 (out), FLEXCOM4_IO4_PA14 (in), FLEXCOM4_IO4_PA14 (out), FLEXCOM4_IO5_PA19 (in), FLEXCOM4_IO5_PA19 (out), FLEXCOM4_IO6_PA20 (in), FLEXCOM4_IO6_PA20 (out), FLEXCOM10_IO0_PB20 (bidir), FLEXCOM10_IO1_PB19 (in), FLEXCOM10_IO1_PB19 (out), GMAC0_INT_PC1 (in), GMAC0_MDC_PA31 (out), GMAC0_MDIO_PB0 (bidir), GMAC0_RX0_PA29 (in), GMAC0_RX1_PA30 (in), GMAC0_RX2_PB2 (in), GMAC0_RX3_PB6 (in), GMAC0_RXCK_PB3 (in), GMAC0_RXCTL_PA28 (in), GMAC0_TX0_PA26 (out), GMAC0_TX1_PA27 (out), GMAC0_TX2_PB4 (out), GMAC0_TX3_PB5 (out), GMAC0_TXCK_PB1 (out), GMAC0_TXCTL_PA25 (out), GMAC1_IRQ_PE3 (in), GMAC1_MDC_PD25 (out), GMAC1_MDIO_PD26 (bidir), GMAC1_MISO_PA17 (in), GMAC1_MOSI_PA18 (out), GMAC1_RX0_PD27 (in), GMAC1_RX1_PD28 (in), GMAC1_RX2_PD30 (in), GMAC1_RX3_PD31 (in), GMAC1_RXCK_PE2 (in), GMAC1_RXCTL_PD24 (in), GMAC1_SPCK_PA16 (out), GMAC1_SPI_CS_PA20 (out), GMAC1_TWCK_PB19 (out), GMAC1_TWD_PB20 (bidir), GMAC1_TX0_PD22 (out), GMAC1_TX1_PD23 (out), GMAC1_TX2_PE0 (out), GMAC1_TX3_PE1 (out), GMAC1_TXCK_PD29 (out), GMAC1_TXEN_PD21 (out), HHSA_CC1_PB31 (in), HHSA_CC2_PC0 (in), JTAG_NTRST_PC22 (out), JTAG_TCK_PC23 (out), JTAG_TDI_PC25 (in), JTAG_TDO_PC26 (out), JTAG_TMS_PC24 (out), LCD_LVDS_CK_N (out), LCD_LVDS_CK_P (out), LCD_LVDS_D0_N (out), LCD_LVDS_D0_P (out), LCD_LVDS_D1_N (out), LCD_LVDS_D1_P (out), LCD_LVDS_D2_N (out), LCD_LVDS_D2_P (out), LCD_LVDS_D3_N (out), LCD_LVDS_D3_P (out), LED_BLUE_PA21 (out), LED_GREEN_PB15 (out), LED_RED_PB17 (out), LVDS_ENABLE_PB18 (out), LVDS_IRQ_PB16 (in), LVDS_PWM_PB14 (out), LVDS_TWCK_PC6 (out), LVDS_TWD_PC7 (bidir), MBUS1_AN_PC5 (in), MBUS1_INT_PB7 (in), MBUS1_MISO_PA17 (in), MBUS1_MOSI_PA18 (out), MBUS1_PWM_PB15 (out), MBUS1_RX/CAN0_RX_PD9 (in), MBUS1_SCK_PA16 (out), MBUS1_SPI_CS_PA15 (out), MBUS1_TWCK_PC6 (out), MBUS1_TWD_PC7 (bidir), MBUS1_TX/CAN0_TX_PD8 (out), MBUS2_AN_PC13 (in), MBUS2_INT_PA22 (in), MBUS2_MISO_PA17 (in), MBUS2_MOSI_PA18 (out), MBUS2_PWM_PB17 (out), MBUS2_RX/CAN4_RX_PD17 (in), MBUS2_SCK_PA16 (out), MBUS2_SPI_CS_PA14 (out), MBUS2_TWCK_PC6 (out), MBUS2_TWD_PC7 (bidir), MBUS2_TX/CAN4_TX_PD16 (out), MBUS_nRST_PC9 (out), MCP16502_INT_PC2 (in), MCP16502_TWCK_PB19 (out), MCP16502_TWD_PB20 (bidir), MIPI_ENABLE_PB18 (out), MIPI_IRQ_PB16 (in), MIPI_PWM_PB14 (out), MIPI_TWCK_PC6 (out), MIPI_TWD_PC7 (bidir), NAND_ALE_PA1 (out), NAND_CLE_PA2 (out), NAND_CS_PA13 (out), NAND_D0_PA3 (bidir), NAND_D1_PA4 (bidir), NAND_D2_PA9 (bidir), NAND_D3_PA10 (bidir), NAND_D4_PA5 (bidir), NAND_D5_PA6 (bidir), NAND_D6_PA7 (bidir), NAND_D7_PA8 (bidir), NAND_RDY_PA11 (in), NAND_RE_PA12 (out), NAND_WE_PA0 (out), PAC1934_INT_PB31 (in), PAC1934_TWCK_PB19 (out), PAC1934_TWD_PB20 (bidir), PIOBU0_WAKE (in), PIOBU1_WAKE (in), PIOBU2 (bidir), PIOBU3 (bidir), QSPI0_CS_PB12 (out), QSPI0_IO0_PB11 (bidir), QSPI0_IO1_PB10 (bidir), QSPI0_IO2_PB9 (bidir), QSPI0_IO3_PB8 (bidir), QSPI0_SCK_PB13 (out), RPI_GPCLK0_PB31 (bidir), RPI_GPCLK1_PD20 (bidir), RPI_GPCLK2_PC0 (bidir), RPI_GPIO16_PC18 (bidir), RPI_GPIO17_PC3 (bidir), RPI_GPIO22_PD1 (bidir), RPI_GPIO23_PD2 (bidir), RPI_GPIO24_PC12 (bidir), RPI_GPIO25_PC11 (bidir), RPI_GPIO26_PC19 (bidir), RPI_GPIO27_PC4 (bidir), RPI_I2S_CK_PC16 (out), RPI_I2S_DIN0_PC14 (in), RPI_I2S_DOUT0_PC17 (out), RPI_I2S_WS_PC15 (out), RPI_MISO_PA17 (in), RPI_MOSI_PA18 (out), RPI_NPCS0_PA19 (out), RPI_NPCS1_PA20 (out), RPI_PWM0_PB15 (out), RPI_PWM1_PB17 (out), RPI_RXD_PA23 (in), RPI_SPCK_PA16 (out), RPI_TWCK_PC6 (out), RPI_TWD_PC7 (bidir), RPI_TXD_PA24 (out), SDMMC1_1V8SEL_PB30 (out), SDMMC1_CD_PB29 (in), SDMMC1_CK_PB23 (out), SDMMC1_CMD_PB22 (bidir), SDMMC1_DAT0_PB24 (bidir), SDMMC1_DAT1_PB25 (bidir), SDMMC1_DAT2_PB26 (bidir), SDMMC1_DAT3_PB27 (bidir), SDMMC1_NRST_PB21 (out), SDMMC1_WP_PB28 (in), SDMMC2_CK_PC28 (out), SDMMC2_CMD_PC27 (out), SDMMC2_DAT0_PC29 (bidir), SDMMC2_DAT1_PC30 (bidir), SDMMC2_DAT2_PC31 (bidir), SDMMC2_DAT3_PD0 (bidir), USBA_VBUS_DETECT_PC8 (in), USBB_EN_5V_PC20 (out), USBB_OVCUR_PC18 (in), USBC_EN_5V_PC21 (out), USBC_OVCUR_PC19 (in), USER_BUTTON_PC10 (in), WIFI_IRQN_PD1 (out), WIFI_RSTN_PD20 (out), WIFI_SPI_MISO_PC28 (in), WIFI_SPI_MOSI_PC27 (out), WIFI_SPI_SCK_PC29 (out), WIFI_TWCK_PC6 (out), WIFI_TWD_PC7 (bidir), WIFI_TWI_IRQ_PD2 (in), WIFI_WAKE_HOST_PD4 (in)

### Nets
VDD_3V3: R63.2 R65.2 R68.2 R73.2 R83.1 R85.1 R106.1 R110.1
BT_CTS_PD5: U5.A19(PD5) ; port BT_CTS_PD5
BT_RTS_PD3: U5.B18(PD3) ; port BT_RTS_PD3
BT_RXD_PD6: U5.G10(PD6) ; port BT_RXD_PD6
BT_TXD_PD7: U5.A20(PD7) ; port BT_TXD_PD7
CAN1_RX_PD11: U5.H11(PD11) ; port CAN1_RX_PD11
CAN1_TX_PD10: U5.G16(PD10) ; port CAN1_TX_PD10
CAN2_RX_PD13: U5.J11(PD13) ; port CAN2_RX_PD13
CAN2_TX_PD12: U5.D18(PD12) ; port CAN2_TX_PD12
CAN3_RX_PD15: U5.H12(PD15) ; port CAN3_RX_PD15
CAN3_TX_PD14: U5.C18(PD14) ; port CAN3_TX_PD14
DBGU_RX_PD19: U5.F18(PD19) ; port DBGU_RX_PD19
DBGU_TX_PD18: U5.H16(PD18) ; port DBGU_TX_PD18
EEPROM_TWCK_PB19: R81.2 ; port EEPROM_TWCK_PB19
EEPROM_TWD_PB20: R91.2 ; port EEPROM_TWD_PB20
FLEXCOM0_IO0_PC7: R110.2 R111.1 R113.1 R115.1 R117.1 R118.1 R120.1 U5.B1(PC7) ; port FLEXCOM0_IO0_PC7
FLEXCOM0_IO1_PC6: R98.1 R100.1 R101.1 R103.1 R105.1 R106.2 R107.1 U5.H6(PC6) ; port FLEXCOM0_IO1_PC6
FLEXCOM4_IO0_PA18: R50.1 R51.1 R52.1 R53.1 U5.W16(PA18) ; port FLEXCOM4_IO0_PA18
FLEXCOM4_IO1_PA17: R54.1 R55.1 R56.1 R57.1 U5.R9(PA17) ; port FLEXCOM4_IO1_PA17
FLEXCOM4_IO2_PA16: R58.1 R59.1 R60.1 R61.1 U5.V15(PA16) ; port FLEXCOM4_IO2_PA16
FLEXCOM4_IO3_PA15: R62.1 R63.1 U5.N11(PA15) ; port FLEXCOM4_IO3_PA15
FLEXCOM4_IO4_PA14: R64.1 R65.1 U5.V14(PA14) ; port FLEXCOM4_IO4_PA14
FLEXCOM4_IO5_PA19: R66.1 R68.1 U5.W18(PA19) ; port FLEXCOM4_IO5_PA19
FLEXCOM4_IO6_PA20: R70.1 R71.1 R73.1 U5.R10(PA20) ; port FLEXCOM4_IO6_PA20
FLEXCOM10_IO0_PB20: R85.2 R87.1 R89.1 R91.1 R92.1 U5.M12(PB20) ; port FLEXCOM10_IO0_PB20
FLEXCOM10_IO1_PB19: R77.1 R79.1 R81.1 R83.2 R84.1 U5.L14(PB19) ; port FLEXCOM10_IO1_PB19
GMAC0_INT_PC1: U5.C8(PC1) ; port GMAC0_INT_PC1
GMAC0_MDC_PA31: U5.F21(PA31) ; port GMAC0_MDC_PA31
GMAC0_MDIO_PB0: U5.M10(PB0) ; port GMAC0_MDIO_PB0
GMAC0_RX0_PA29: U5.D21(PA29) ; port GMAC0_RX0_PA29
GMAC0_RX1_PA30: U5.K15(PA30) ; port GMAC0_RX1_PA30
GMAC0_RX2_PB2: U5.J14(PB2) ; port GMAC0_RX2_PB2
GMAC0_RX3_PB6: U5.K13(PB6) ; port GMAC0_RX3_PB6
GMAC0_RXCK_PB3: U5.J21(PB3) ; port GMAC0_RXCK_PB3
GMAC0_RXCTL_PA28: U5.L13(PA28) ; port GMAC0_RXCTL_PA28
GMAC0_TX0_PA26: U5.K14(PA26) ; port GMAC0_TX0_PA26
GMAC0_TX1_PA27: U5.C21(PA27) ; port GMAC0_TX1_PA27
GMAC0_TX2_PB4: U5.J15(PB4) ; port GMAC0_TX2_PB4
GMAC0_TX3_PB5: U5.J20(PB5) ; port GMAC0_TX3_PB5
GMAC0_TXCK_PB1: U5.G21(PB1) ; port GMAC0_TXCK_PB1
GMAC0_TXCTL_PA25: U5.B21(PA25) ; port GMAC0_TXCTL_PA25
GMAC1_IRQ_PE3: U5.D20(PE3) ; port GMAC1_IRQ_PE3
GMAC1_MDC_PD25: U5.K9(PD25) ; port GMAC1_MDC_PD25
GMAC1_MDIO_PD26: U5.D19(PD26) ; port GMAC1_MDIO_PD26
GMAC1_MISO_PA17: R57.2 ; port GMAC1_MISO_PA17
GMAC1_MOSI_PA18: R53.2 ; port GMAC1_MOSI_PA18
GMAC1_RX0_PD27: U5.K10(PD27) ; port GMAC1_RX0_PD27
GMAC1_RX1_PD28: U5.C19(PD28) ; port GMAC1_RX1_PD28
GMAC1_RX2_PD30: U5.B19(PD30) ; port GMAC1_RX2_PD30
GMAC1_RX3_PD31: U5.F20(PD31) ; port GMAC1_RX3_PD31
GMAC1_RXCK_PE2: U5.K12(PE2) ; port GMAC1_RXCK_PE2
GMAC1_RXCTL_PD24: U5.G19(PD24) ; port GMAC1_RXCTL_PD24
GMAC1_SPCK_PA16: R61.2 ; port GMAC1_SPCK_PA16
GMAC1_SPI_CS_PA20: R71.2 ; port GMAC1_SPI_CS_PA20
GMAC1_TWCK_PB19: R84.2 ; port GMAC1_TWCK_PB19
GMAC1_TWD_PB20: R92.2 ; port GMAC1_TWD_PB20
GMAC1_TX0_PD22: U5.F19(PD22) ; port GMAC1_TX0_PD22
GMAC1_TX1_PD23: U5.G18(PD23) ; port GMAC1_TX1_PD23
GMAC1_TX2_PE0: U5.H17(PE0) ; port GMAC1_TX2_PE0
GMAC1_TX3_PE1: U5.G20(PE1) ; port GMAC1_TX3_PE1
GMAC1_TXCK_PD29: U5.H18(PD29) ; port GMAC1_TXCK_PD29
GMAC1_TXEN_PD21: U5.H15(PD21) ; port GMAC1_TXEN_PD21
HHSA_CC1_PB31: R116.1 ; port HHSA_CC1_PB31
HHSA_CC2_PC0: R121.1 ; port HHSA_CC2_PC0
JTAG_NTRST_PC22: U5.F4(PC22) ; port JTAG_NTRST_PC22
JTAG_TCK_PC23: U5.A3(PC23) ; port JTAG_TCK_PC23
JTAG_TDI_PC25: U5.B3(PC25) ; port JTAG_TDI_PC25
JTAG_TDO_PC26: U5.G6(PC26) ; port JTAG_TDO_PC26
JTAG_TMS_PC24: U5.F5(PC24) ; port JTAG_TMS_PC24
LCD_LVDS_CK_N: U5.AA18(PE12) ; port LCD_LVDS_CK_N
LCD_LVDS_CK_P: U5.Y18(PE13) ; port LCD_LVDS_CK_P
LCD_LVDS_D0_N: U5.AA13(PE4) ; port LCD_LVDS_D0_N
LCD_LVDS_D0_P: U5.Y13(PE5) ; port LCD_LVDS_D0_P
LCD_LVDS_D1_N: U5.AA15(PE6) ; port LCD_LVDS_D1_N
LCD_LVDS_D1_P: U5.Y15(PE7) ; port LCD_LVDS_D1_P
LCD_LVDS_D2_N: U5.AA16(PE8) ; port LCD_LVDS_D2_N
LCD_LVDS_D2_P: U5.Y16(PE9) ; port LCD_LVDS_D2_P
LCD_LVDS_D3_N: U5.AA19(PE10) ; port LCD_LVDS_D3_N
LCD_LVDS_D3_P: U5.Y19(PE11) ; port LCD_LVDS_D3_P
LED_BLUE_PA21: U5.W19(PA21) ; port LED_BLUE_PA21
LED_GREEN_PB15: R78.2 ; port LED_GREEN_PB15
LED_RED_PB17: R86.2 ; port LED_RED_PB17
LVDS_ENABLE_PB18: R76.2 ; port LVDS_ENABLE_PB18
LVDS_IRQ_PB16: R74.2 ; port LVDS_IRQ_PB16
LVDS_PWM_PB14: R69.2 ; port LVDS_PWM_PB14
LVDS_TWCK_PC6: R98.2 ; port LVDS_TWCK_PC6
LVDS_TWD_PC7: R111.2 ; port LVDS_TWD_PC7
MBUS1_AN_PC5: U5.G3(PC5) ; port MBUS1_AN_PC5
MBUS1_INT_PB7: U5.C20(PB7) ; port MBUS1_INT_PB7
MBUS1_MISO_PA17: R54.2 ; port MBUS1_MISO_PA17
MBUS1_MOSI_PA18: R50.2 ; port MBUS1_MOSI_PA18
MBUS1_PWM_PB15: R80.2 ; port MBUS1_PWM_PB15
MBUS1_RX/CAN0_RX_PD9: U5.F14(PD9) ; port MBUS1_RX/CAN0_RX_PD9
MBUS1_SCK_PA16: R58.2 ; port MBUS1_SCK_PA16
MBUS1_SPI_CS_PA15: R62.2 ; port MBUS1_SPI_CS_PA15
MBUS1_TWCK_PC6: R101.2 ; port MBUS1_TWCK_PC6
MBUS1_TWD_PC7: R115.2 ; port MBUS1_TWD_PC7
MBUS1_TX/CAN0_TX_PD8: U5.G14(PD8) ; port MBUS1_TX/CAN0_TX_PD8
MBUS2_AN_PC13: U5.D1(PC13) ; port MBUS2_AN_PC13
MBUS2_INT_PA22: U5.P10(PA22) ; port MBUS2_INT_PA22
MBUS2_MISO_PA17: R55.2 ; port MBUS2_MISO_PA17
MBUS2_MOSI_PA18: R51.2 ; port MBUS2_MOSI_PA18
MBUS2_PWM_PB17: R88.2 ; port MBUS2_PWM_PB17
MBUS2_RX/CAN4_RX_PD17: U5.H13(PD17) ; port MBUS2_RX/CAN4_RX_PD17
MBUS2_SCK_PA16: R59.2 ; port MBUS2_SCK_PA16
MBUS2_SPI_CS_PA14: R64.2 ; port MBUS2_SPI_CS_PA14
MBUS2_TWCK_PC6: R103.2 ; port MBUS2_TWCK_PC6
MBUS2_TWD_PC7: R117.2 ; port MBUS2_TWD_PC7
MBUS2_TX/CAN4_TX_PD16: U5.E18(PD16) ; port MBUS2_TX/CAN4_TX_PD16
MBUS_nRST_PC9: U5.D6(PC9) ; port MBUS_nRST_PC9
MCP16502_INT_PC2: U5.D7(PC2) ; port MCP16502_INT_PC2
MCP16502_TWCK_PB19: R77.2 ; port MCP16502_TWCK_PB19
MCP16502_TWD_PB20: R87.2 ; port MCP16502_TWD_PB20
MIPI_ENABLE_PB18: R75.2 ; port MIPI_ENABLE_PB18
MIPI_IRQ_PB16: R72.2 ; port MIPI_IRQ_PB16
MIPI_PWM_PB14: R67.2 ; port MIPI_PWM_PB14
MIPI_TWCK_PC6: R100.2 ; port MIPI_TWCK_PC6
MIPI_TWD_PC7: R113.2 ; port MIPI_TWD_PC7
NAND_ALE_PA1: U5.V17(PA1) ; port NAND_ALE_PA1
NAND_CLE_PA2: U5.R14(PA2) ; port NAND_CLE_PA2
NAND_CS_PA13: U5.P11(PA13) ; port NAND_CS_PA13
NAND_D0_PA3: U5.T18(PA3) ; port NAND_D0_PA3
NAND_D1_PA4: U5.P16(PA4) ; port NAND_D1_PA4
NAND_D2_PA9: U5.U14(PA9) ; port NAND_D2_PA9
NAND_D3_PA10: U5.R12(PA10) ; port NAND_D3_PA10
NAND_D4_PA5: U5.V16(PA5) ; port NAND_D4_PA5
NAND_D5_PA6: U5.T14(PA6) ; port NAND_D5_PA6
NAND_D6_PA7: U5.P15(PA7) ; port NAND_D6_PA7
NAND_D7_PA8: U5.R13(PA8) ; port NAND_D7_PA8
NAND_RDY_PA11: U5.P12(PA11) ; port NAND_RDY_PA11
NAND_RE_PA12: U5.W15(PA12) ; port NAND_RE_PA12
NAND_WE_PA0: U5.U18(PA0) ; port NAND_WE_PA0
PAC1934_INT_PB31: R112.2 ; port PAC1934_INT_PB31
PAC1934_TWCK_PB19: R79.2 ; port PAC1934_TWCK_PB19
PAC1934_TWD_PB20: R89.2 ; port PAC1934_TWD_PB20
PB14: R67.1 R69.1 U5.N15(PB14)
PB15: R78.1 R80.1 R82.1 U5.M15(PB15)
PB16: R72.1 R74.1 U5.N20(PB16)
PB17: R86.1 R88.1 R90.1 U5.M14(PB17)
PB18: R75.1 R76.1 U5.N21(PB18)
PB31: R112.1 R114.1 R116.2 U5.C5(PB31)
PC0: R119.1 R121.2 U5.J8(PC0)
PC18: R102.1 R104.1 U5.F7(PC18)
PC19: R108.1 R109.1 U5.D5(PC19)
PC27: R93.1 R94.1 U5.C15(PC27)
PC28: R95.1 R96.1 U5.D16(PC28)
PC29: R97.1 R99.1 U5.B16(PC29)
PD1: R122.1 R123.1 U5.A18(PD1)
PD2: R124.1 R125.1 U5.G13(PD2)
PD20: R126.1 R127.1 U5.J12(PD20)
PIOBU0_WAKE: U5.J10(PIOBU0) ; port PIOBU0_WAKE
PIOBU1_WAKE: U5.A5(PIOBU1) ; port PIOBU1_WAKE
PIOBU2: U5.D8(PIOBU2) ; port PIOBU2
PIOBU3: U5.A4(PIOBU3) ; port PIOBU3
QSPI0_CS_PB12: U5.P18(PB12) ; port QSPI0_CS_PB12
QSPI0_IO0_PB11: U5.R19(PB11) ; port QSPI0_IO0_PB11
QSPI0_IO1_PB10: U5.P17(PB10) ; port QSPI0_IO1_PB10
QSPI0_IO2_PB9: U5.R18(PB9) ; port QSPI0_IO2_PB9
QSPI0_IO3_PB8: U5.T19(PB8) ; port QSPI0_IO3_PB8
QSPI0_SCK_PB13: U5.N14(PB13) ; port QSPI0_SCK_PB13
RPI_GPCLK0_PB31: R114.2 ; port RPI_GPCLK0_PB31
RPI_GPCLK1_PD20: R127.2 ; port RPI_GPCLK1_PD20
RPI_GPCLK2_PC0: R119.2 ; port RPI_GPCLK2_PC0
RPI_GPIO16_PC18: R104.2 ; port RPI_GPIO16_PC18
RPI_GPIO17_PC3: U5.G8(PC3) ; port RPI_GPIO17_PC3
RPI_GPIO22_PD1: R123.2 ; port RPI_GPIO22_PD1
RPI_GPIO23_PD2: R125.2 ; port RPI_GPIO23_PD2
RPI_GPIO24_PC12: U5.H5(PC12) ; port RPI_GPIO24_PC12
RPI_GPIO25_PC11: U5.C1(PC11) ; port RPI_GPIO25_PC11
RPI_GPIO26_PC19: R109.2 ; port RPI_GPIO26_PC19
RPI_GPIO27_PC4: U5.C2(PC4) ; port RPI_GPIO27_PC4
RPI_I2S_CK_PC16: U5.H4(PC16) ; port RPI_I2S_CK_PC16
RPI_I2S_DIN0_PC14: U5.J7(PC14) ; port RPI_I2S_DIN0_PC14
RPI_I2S_DOUT0_PC17: U5.D4(PC17) ; port RPI_I2S_DOUT0_PC17
RPI_I2S_WS_PC15: U5.F3(PC15) ; port RPI_I2S_WS_PC15
RPI_MISO_PA17: R56.2 ; port RPI_MISO_PA17
RPI_MOSI_PA18: R52.2 ; port RPI_MOSI_PA18
RPI_NPCS0_PA19: R66.2 ; port RPI_NPCS0_PA19
RPI_NPCS1_PA20: R70.2 ; port RPI_NPCS1_PA20
RPI_PWM0_PB15: R82.2 ; port RPI_PWM0_PB15
RPI_PWM1_PB17: R90.2 ; port RPI_PWM1_PB17
RPI_RXD_PA23: U5.AA20(PA23) ; port RPI_RXD_PA23
RPI_SPCK_PA16: R60.2 ; port RPI_SPCK_PA16
RPI_TWCK_PC6: R105.2 ; port RPI_TWCK_PC6
RPI_TWD_PC7: R118.2 ; port RPI_TWD_PC7
RPI_TXD_PA24: U5.P9(PA24) ; port RPI_TXD_PA24
SDMMC1_1V8SEL_PB30: U5.A2(PB30) ; port SDMMC1_1V8SEL_PB30
SDMMC1_CD_PB29: U5.G4(PB29) ; port SDMMC1_CD_PB29
SDMMC1_CK_PB23: U5.D14(PB23) ; port SDMMC1_CK_PB23
SDMMC1_CMD_PB22: U5.C14(PB22) ; port SDMMC1_CMD_PB22
SDMMC1_DAT0_PB24: U5.B15(PB24) ; port SDMMC1_DAT0_PB24
SDMMC1_DAT1_PB25: U5.A13(PB25) ; port SDMMC1_DAT1_PB25
SDMMC1_DAT2_PB26: U5.A15(PB26) ; port SDMMC1_DAT2_PB26
SDMMC1_DAT3_PB27: U5.C11(PB27) ; port SDMMC1_DAT3_PB27
SDMMC1_NRST_PB21: U5.D15(PB21) ; port SDMMC1_NRST_PB21
SDMMC1_WP_PB28: U5.C3(PB28) ; port SDMMC1_WP_PB28
SDMMC2_CK_PC28: R95.2 ; port SDMMC2_CK_PC28
SDMMC2_CMD_PC27: R93.2 ; port SDMMC2_CMD_PC27
SDMMC2_DAT0_PC29: R97.2 ; port SDMMC2_DAT0_PC29
SDMMC2_DAT1_PC30: U5.D17(PC30) ; port SDMMC2_DAT1_PC30
SDMMC2_DAT2_PC31: U5.A16(PC31) ; port SDMMC2_DAT2_PC31
SDMMC2_DAT3_PD0: U5.C16(PD0) ; port SDMMC2_DAT3_PD0
USBA_VBUS_DETECT_PC8: U5.E6(PC8) ; port USBA_VBUS_DETECT_PC8
USBB_EN_5V_PC20: U5.C6(PC20) ; port USBB_EN_5V_PC20
USBB_OVCUR_PC18: R102.2 ; port USBB_OVCUR_PC18
USBC_EN_5V_PC21: U5.F8(PC21) ; port USBC_EN_5V_PC21
USBC_OVCUR_PC19: R108.2 ; port USBC_OVCUR_PC19
USER_BUTTON_PC10: U5.H7(PC10) ; port USER_BUTTON_PC10
WIFI_IRQN_PD1: R122.2 ; port WIFI_IRQN_PD1
WIFI_RSTN_PD20: R126.2 ; port WIFI_RSTN_PD20
WIFI_SPI_MISO_PC28: R96.2 ; port WIFI_SPI_MISO_PC28
WIFI_SPI_MOSI_PC27: R94.2 ; port WIFI_SPI_MOSI_PC27
WIFI_SPI_SCK_PC29: R99.2 ; port WIFI_SPI_SCK_PC29
WIFI_TWCK_PC6: R107.2 ; port WIFI_TWCK_PC6
WIFI_TWD_PC7: R120.2 ; port WIFI_TWD_PC7
WIFI_TWI_IRQ_PD2: R124.2 ; port WIFI_TWI_IRQ_PD2
WIFI_WAKE_HOST_PD4: U5.G12(PD4) ; port WIFI_WAKE_HOST_PD4

### Notes on the sheet
- FLEXCOM4_IO1
- FLEXCOM4_IO2
- FLEXCOM4_IO3
- FLEXCOM4_IO4
- FLEXCOM4_IO0
- FLEXCOM4_IO5
- FLEXCOM4_IO6
- FLEXCOM10_IO1
- FLEXCOM10_IO0
- FLEXCOM3_IO0
- FLEXCOM3_IO1
- FLEXCOM0_IO1
- FLEXCOM1_IO1
- FLEXCOM1_IO3
- FLEXCOM1_IO4
- FLEXCOM0_IO0
- FLEXCOM1_IO0
- FLEXCOM7_IO0
- FLEXCOM7_IO1
- FLEXCOM5_IO0
- FLEXCOM5_IO1
- FLEXCOM6_IO0
- FLEXCOM6_IO1
- Project Owner:
- PCB Layout Contact:
- PartNumber:
- Project Title
- Variant:
- Sheet Title
- Size
- B
- SCH #:
- PCB #:
- Rev:
- Date:
- Sheet
- Designed with
- Altium.com <http://go.altium.com/MicrochipLandingPage_Evaluation.html>
- File:

### Library data of the parts
R50-R62 R64 R66 R67 R69-R72 R74-R82 R84 R86-R93 R95 R97 R98 R100-R103 R105 R107 R108 R111-R113 R115 R117-R120 R122 R124 R126 = RES1474: Manufacturer 1: Panasonic Electronic Components; Manufacturer Part Number 1: ERJ-2RKF22R0X; Description_: RES TKF 22R 1% 1/20W SMD 0402; Dev Tools Status: Production; Power: 1/10W; Populated: YES; Owner: Mike Ragsdale; Temperature Coefficient: 100ppm/C; Circuit Type: Isolated; MCHP-ID: RES1474; Revision: 2; Symbol: Resistor; Status: MCL Design; ComponentLink1Description: SVN Datasheet; ComponentLink2Description: Local Datasheet; ComponentLink3URL: C:\ALTIUM_WORK\00001_MCHP-CDB\Library\LibraryRefs\Resistor.SchLib; ComponentLink3Description: Open Symbol; ComponentLink4URL: C:\ALTIUM_WORK\00001_MCHP-CDB\Library\Footprints\RES_C_0402.PcbLib; ComponentLink4Description: Open Footprint; ComponentLink5Description: Open Footprint 2; ComponentLink6Description: Open Footprint 3; ComponentLink7Description: Open Footprint 4; Operating Temperature: -55C to +155C; Category: Resistor; Type: RES SMD; Composition: TKF; Supplier 1: Digi-Key; Supplier Part Number 1: P22.0LCT-ND; Quantity Override: 1
R63 R65 R68 R73 = RSMT1019: Manufacturer 1: Panasonic; Manufacturer Part Number 1: ERJ-2RKF1002X; Description_: RES TKF 10k 1% 1/10W SMD 0402; Dev Tools Status: Production; Voltage: 50V; Temperature Coeffcient: 100ppm/C; Power: 1/10W; Owner: Brent Lanphear; Populated: YES; MCHP-ID: RSMT1019; Revision: 2; Symbol: Resistor; Status: MCL Design; ComponentLink1URL: https://chn-vm-apps.microchip.com/mchprepo/parts/Datasheets/AOA0000CE2.pdf; ComponentLink1Description: SVN Datasheet; ComponentLink2URL: C:\ALTIUM_WORK\00001_MCHP-CDB\Datasheets\AOA0000CE2.pdf; ComponentLink2Description: Local Datasheet; ComponentLink3URL: C:\ALTIUM_WORK\00001_MCHP-CDB\Library\LibraryRefs\Resistor.SchLib; ComponentLink3Description: Open Symbol; ComponentLink4URL: C:\ALTIUM_WORK\00001_MCHP-CDB\Library\Footprints\RES_C_0402.PcbLib; ComponentLink4Description: Open Footprint; ComponentLink5Description: Open Footprint 2; ComponentLink6Description: Open Footprint 3; ComponentLink7Description: Open Footprint 4; Operating Temperature: -55C to +155C; Category: Resistor; Type: RES SMD; Composition: TKF; Supplier 1: Digi-Key; Supplier Part Number 1: P10.0KLCT-ND; Quantity Override: 1
R83 R85 R106 R110 = RES1023: Manufacturer 1: Panasonic; Manufacturer Part Number 1: ERJ-2RKF2201X; Description_: RES TKF 2.2k 1% 1/10W SMD 0402; Dev Tools Status: Production; Power: 1/10W; Populated: YES; Owner: Tad Ahlvers; Temperature Coefficient: 100ppm/C; Voltage: 50V; MCHP-ID: RES1023; Revision: 1; Symbol: Resistor; Status: MCL Design; ComponentLink1Description: SVN Datasheet; ComponentLink2Description: Local Datasheet; ComponentLink3URL: C:\ALTIUM_WORK\00001_MCHP-CDB\Library\LibraryRefs\Resistor.SchLib; ComponentLink3Description: Open Symbol; ComponentLink4URL: C:\ALTIUM_WORK\00001_MCHP-CDB\Library\Footprints\RES_C_0402.PcbLib; ComponentLink4Description: Open Footprint; ComponentLink5Description: Open Footprint 2; ComponentLink6Description: Open Footprint 3; ComponentLink7Description: Open Footprint 4; Operating Temperature: -55C to +155C; Category: Resistor; Type: RES SMD; Composition: TKF; Supplier 1: Digi-Key; Supplier Part Number 1: P2.20KLTR-ND; Quantity Override: 1; ComponentLink1URL: https://chn-vm-apps.microchip.com/mchprepo/parts/Datasheets/AOA0000CE2.pdf; ComponentLink2URL: C:\ALTIUM_WORK\00001_MCHP-CDB\Datasheets\AOA0000CE2.pdf
R94 R96 R99 = RES1474: Manufacturer 1: Panasonic Electronic Components; Manufacturer Part Number 1: ERJ-2RKF22R0X; Description_: RES TKF 22R 1% 1/20W SMD 0402; Dev Tools Status: Production; Power: 1/10W; Populated: Yes; Owner: Mike Ragsdale; Temperature Coefficient: 100ppm/C; Circuit Type: Isolated; MCHP-ID: RES1474; Revision: 2; Symbol: Resistor; Status: MCL Design; ComponentLink1Description: SVN Datasheet; ComponentLink2Description: Local Datasheet; ComponentLink3URL: C:\ALTIUM_WORK\00001_MCHP-CDB\Library\LibraryRefs\Resistor.SchLib; ComponentLink3Description: Open Symbol; ComponentLink4URL: C:\ALTIUM_WORK\00001_MCHP-CDB\Library\Footprints\RES_C_0402.PcbLib; ComponentLink4Description: Open Footprint; ComponentLink5Description: Open Footprint 2; ComponentLink6Description: Open Footprint 3; ComponentLink7Description: Open Footprint 4; Operating Temperature: -55C to +155C; Category: Resistor; Type: RES SMD; Composition: TKF; Supplier 1: Digi-Key; Supplier Part Number 1: P22.0LCT-ND; Quantity Override: 1
R104 R109 R114 R123 R125 R127 = RES1474: Manufacturer 1: Panasonic Electronic Components; Manufacturer Part Number 1: ERJ-2RKF22R0X; Description_: RES TKF 22R 1% 1/20W SMD 0402; Dev Tools Status: Production; Power: 1/10W; Owner: Mike Ragsdale; Temperature Coefficient: 100ppm/C; Circuit Type: Isolated; MCHP-ID: RES1474; Revision: 2; Symbol: Resistor; Status: MCL Design; ComponentLink1Description: SVN Datasheet; ComponentLink2Description: Local Datasheet; ComponentLink3URL: C:\ALTIUM_WORK\00001_MCHP-CDB\Library\LibraryRefs\Resistor.SchLib; ComponentLink3Description: Open Symbol; ComponentLink4URL: C:\ALTIUM_WORK\00001_MCHP-CDB\Library\Footprints\RES_C_0402.PcbLib; ComponentLink4Description: Open Footprint; ComponentLink5Description: Open Footprint 2; ComponentLink6Description: Open Footprint 3; ComponentLink7Description: Open Footprint 4; Operating Temperature: -55C to +155C; Category: Resistor; Type: RES SMD; Composition: TKF; Supplier 1: Digi-Key; Supplier Part Number 1: P22.0LCT-ND; Quantity Override: 1
R116 R121 = RSMT1040: Manufacturer 1: Yageo; Manufacturer Part Number 1: RC0402JR-070RL; Description_: RES TKF 0R 1/16W SMD 0402; Dev Tools Status: Production; Power: 1/16W; Owner: Sompoch Loboonlert; MCHP-ID: RSMT1040; Revision: 3; Symbol: Resistor; Status: MCL Design; ComponentLink1URL: https://chn-vm-apps.microchip.com/mchprepo/parts/Datasheets/PYu-RC0402_51_RoHS_L_6.pdf; ComponentLink1Description: SVN Datasheet; ComponentLink2URL: C:\ALTIUM_WORK\00001_MCHP-CDB\Datasheets\PYu-RC0402_51_RoHS_L_6.pdf; ComponentLink2Description: Local Datasheet; ComponentLink3URL: C:\ALTIUM_WORK\00001_MCHP-CDB\Library\LibraryRefs\Resistor.SchLib; ComponentLink3Description: Open Symbol; ComponentLink4URL: C:\ALTIUM_WORK\00001_MCHP-CDB\Library\Footprints\RES_C_0402.PcbLib; ComponentLink4Description: Open Footprint; ComponentLink5Description: Open Footprint 2; ComponentLink6Description: Open Footprint 3; ComponentLink7Description: Open Footprint 4; Operating Temperature: -55C to +155C; Category: Resistor; Type: RES SMD; Composition: TKF; Manufacturer 2: Stackpole Electronics Inc; Manufacturer Part Number 2: RMCF0402ZT0R00; Supplier 1: Digi-Key; Supplier Part Number 1: 311-0.0JRCT-ND; Supplier 2: Digi-Key; Supplier Part Number 2: RMCF0402ZT0R00TR-ND; Quantity Override: 1
U5 = IC2674: SAMA7D65 MPU 1000MHz Cortex-A7 TFBGA-343; Manufacturer 1: Microchip Technology; Description_: MCHP MPU 32-BIT Cortex-A7 1000MHz 128kB SAMA7D65-V/4HB-SL3 TFBGA-343; Populated: YES; MCHP-ID: IC2674; Dev Tools Status: Design; Owner: Ciprian Abramov; Restricted Sourcing: No; Manufacturer Part Number 1: SAMA7D65-V/4HB-SL3; Symbol: SAMA7D65-TFBGA-343; Type: 32-Bit MPU; Status: MCL Design; Revision: 1; Category: MCHP-Microcontroller; ComponentLink1URL: https://www.microchip.com/sitesearch/search/Product%20and%20Development%20Tools/SAMA7D65-V/4HB-SL3; ComponentLink1Description: SVN Datasheet; ComponentLink2Description: Local Datasheet; ComponentLink3URL: C:\ALTIUM_WORK\00001_MCHP-CDB\Library\LibraryRefs\SAMA7D65-TFBGA-343.SchLib; ComponentLink3Description: Open Symbol; ComponentLink4URL: C:\ALTIUM_WORK\00001_MCHP-CDB\Library\Footprints\TFBGA-343_14x14.PcbLib; ComponentLink4Description: Open Footprint; ComponentLink5Description: Open Footprint 2; ComponentLink6Description: Open Footprint 3; ComponentLink7Description: Open Footprint 4; Supplier 1: Microchip Technology; Supplier Part Number 1: SAMA7D65-V/4HB-SL3; Operating Temperature: -40C to +105C; Quantity Override: 1